# EasyEDA Pro project ProPrj_SunLight_2026-07-16.epro

# Schematic Schematic1
Assembly Variant: Basic; Board Name: Board1; Create Date: 2026-07-05; Page Name: P1; Project Name: SunLight; Schematic Name: Schematic1; Update Date: 2026-07-05; Company: 嘉立创EDA; Page Size: A4; Version: V1.0
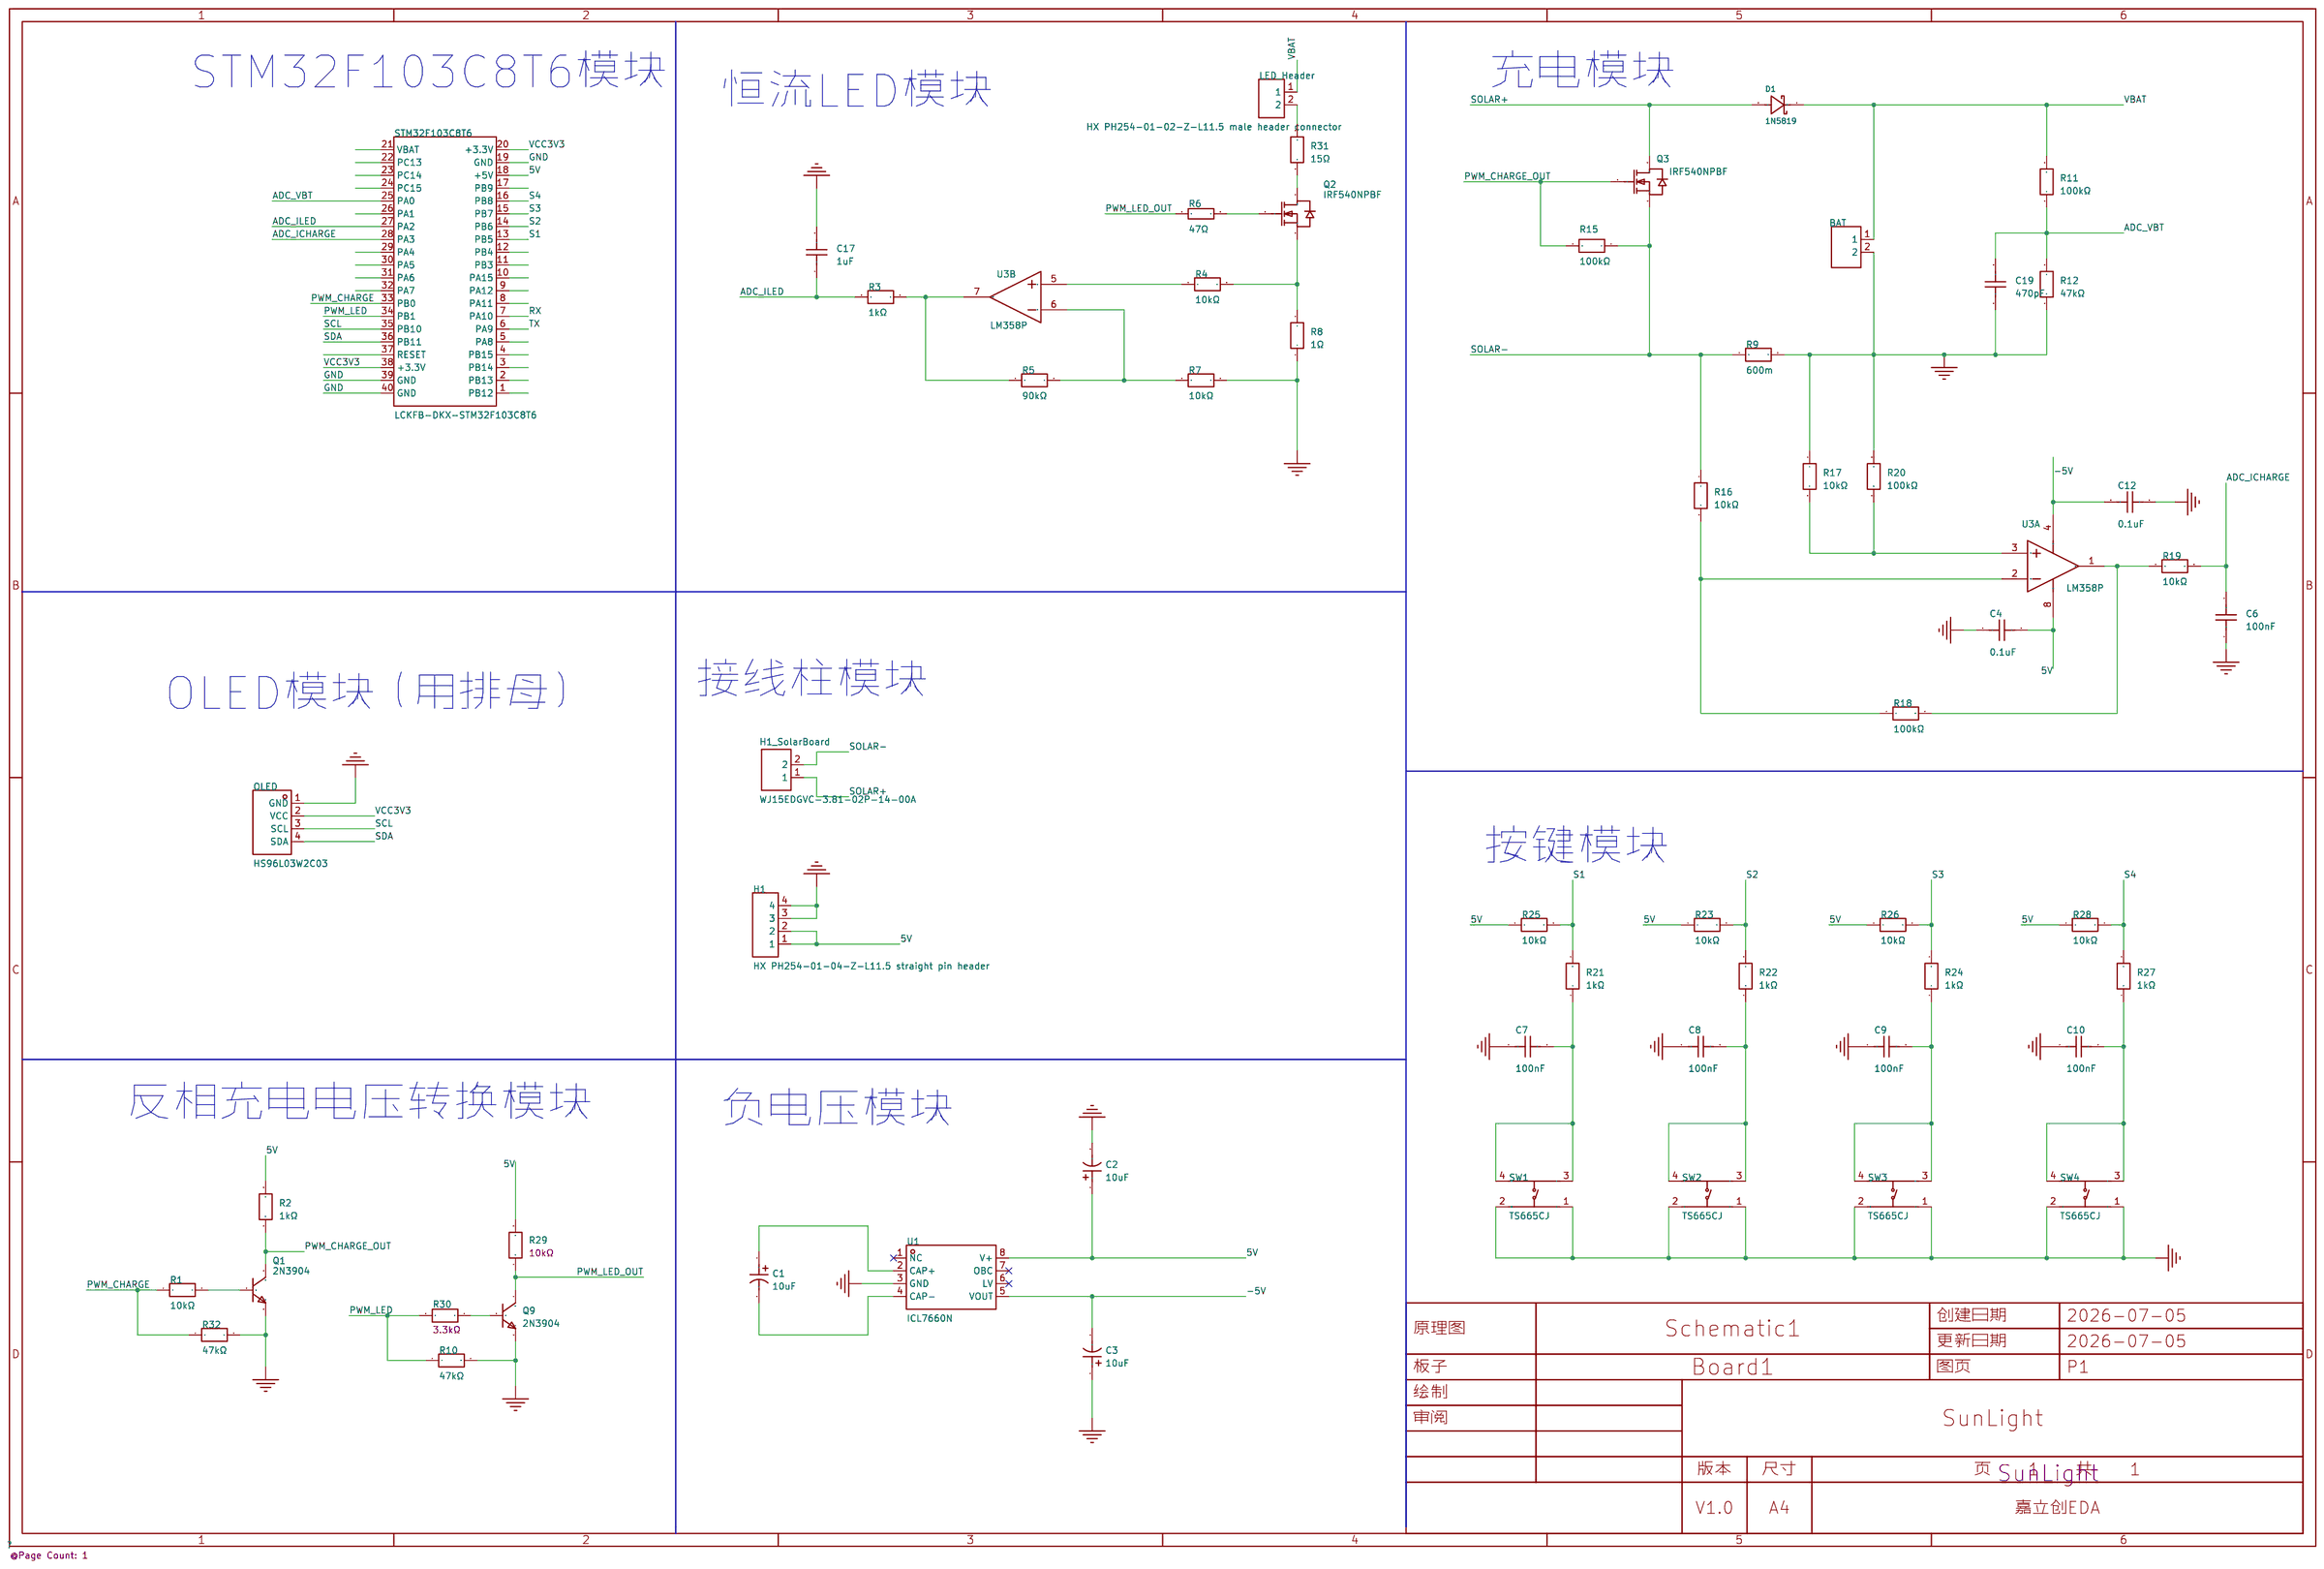
[diagram p0: schematic sheet]

## Parts
BAT  WJ15EDGVC-3.81-02P-14-00A  [CONN-TH_WJ15EDGVC-3.81-2P]
C1  10uF  [CAP-TH_BD10.0-P5.00-D0.6-FD_1]
C2  10uF  [CAP-TH_BD10.0-P5.00-D0.6-FD_1]
C3  10uF  [CAP-TH_BD10.0-P5.00-D0.6-FD_1]
C4  0.1uF  [CC1H104ZA1FD3F6C1000]
C6  100nF  [CAP-TH_L5.5-W4.0-P5.00-D0.5]
C7  100nF  [CAP-TH_L5.5-W4.0-P5.00-D0.5]
C8  100nF  [CAP-TH_L5.5-W4.0-P5.00-D0.5]
C9  100nF  [CAP-TH_L5.5-W4.0-P5.00-D0.5]
C10  100nF  [CAP-TH_L5.5-W4.0-P5.00-D0.5]
C12  0.1uF  [CC1H104ZA1FD3F6C1000]
C17  1uF  [CAP-TH_L5.8-W2.8]
C19  470pF  [CAP-TH_L5.5-W4.0-P5.00-D0.5]
D1  1N5819  [DO-41_BD2.4-L4.7-P8.70-D0.9-RD]
H1  HX PH254-01-04-Z-L11.5 straight pin header  [HDR-TH_4P-HX-PH254-01-04-Z-L11.5]
H1_SolarBoard  WJ15EDGVC-3.81-02P-14-00A  [CONN-TH_WJ15EDGVC-3.81-2P]
LED_Header  HX PH254-01-02-Z-L11.5 male header connector  [HDR-TH_2P-P2.54-V-M]
OLED  HS96L03W2C03  [OLED-TH_L27.8-W27.2-P2.54_C9900033791]
Q1  2N3904  [TO-92-3_L4.6-W3.6-P1.27-L_1]
Q2  IRF540NPBF  [TO-220-3_L10.0-W4.5-P2.54-L]
Q3  IRF540NPBF  [TO-220-3_L10.0-W4.5-P2.54-L]
Q9  2N3904  [TO-92-3_L4.6-W3.6-P1.27-L_1]
R1  10kΩ  [RES-TH_BD2.7-L6.2-P10.20-D0.4]
R2  1kΩ  [RES-TH_BD2.7-L6.2-P10.20-D0.4]
R3  1kΩ  [RES-TH_BD2.7-L6.2-P10.20-D0.4]
R4  10kΩ  [RES-TH_BD2.7-L6.2-P10.20-D0.4]
R5  90kΩ  [RES-TH_BD2.7-L6.2-P10.20-D0.4]
R6  47Ω  [RES-TH_BD2.4-L6.3-P10.30-D0.6]
R7  10kΩ  [RES-TH_BD2.7-L6.2-P10.20-D0.4]
R8  1Ω  [RES-TH_BD2.7-L6.2-P10.20-D0.4]
R9  600m  [RES-TH_BD2.7-L6.2-P10.20-D0.4]
R10  47kΩ  [RES-TH_BD2.7-L6.2-P10.20-D0.4]
R11  100kΩ  [RES-TH_BD2.7-L6.2-P10.20-D0.4]
R12  47kΩ  [RES-TH_BD2.7-L6.2-P10.20-D0.4]
R15  100kΩ  [RES-TH_BD2.7-L6.2-P10.20-D0.4]
R16  10kΩ  [RES-TH_BD2.7-L6.2-P10.20-D0.4]
R17  10kΩ  [RES-TH_BD2.7-L6.2-P10.20-D0.4]
R18  100kΩ  [RES-TH_BD2.7-L6.2-P10.20-D0.4]
R19  10kΩ  [RES-TH_BD2.7-L6.2-P10.20-D0.4]
R20  100kΩ  [RES-TH_BD2.7-L6.2-P10.20-D0.4]
R21  1kΩ  [RES-TH_BD2.7-L6.2-P10.20-D0.4]
R22  1kΩ  [RES-TH_BD2.7-L6.2-P10.20-D0.4]
R23  10kΩ  [RES-TH_BD2.7-L6.2-P10.20-D0.4]
R24  1kΩ  [RES-TH_BD2.7-L6.2-P10.20-D0.4]
R25  10kΩ  [RES-TH_BD2.7-L6.2-P10.20-D0.4]
R26  10kΩ  [RES-TH_BD2.7-L6.2-P10.20-D0.4]
R27  1kΩ  [RES-TH_BD2.7-L6.2-P10.20-D0.4]
R28  10kΩ  [RES-TH_BD2.7-L6.2-P10.20-D0.4]
R29  1kΩ  [RES-TH_BD2.7-L6.2-P10.20-D0.4]
R30  1kΩ  [RES-TH_BD2.7-L6.2-P10.20-D0.4]
R31  15Ω  [RES-TH_BD2.7-L6.2-P10.20-D0.4]
R32  47kΩ  [RES-TH_BD2.7-L6.2-P10.20-D0.4]
STM32F103C8T6  LCKFB-DKX-STM32F103C8T6  [CONN-TH_L53.3-W22.9_STM32F103C8T6-CARD]
SW1  TS665CJ  [SW-TH_4P-L6.0-W6.0-P4.50-LS6.5]
SW2  TS665CJ  [SW-TH_4P-L6.0-W6.0-P4.50-LS6.5]
SW3  TS665CJ  [SW-TH_4P-L6.0-W6.0-P4.50-LS6.5]
SW4  TS665CJ  [SW-TH_4P-L6.0-W6.0-P4.50-LS6.5]
U1  ICL7660N  [DIP-8_L9.4-W6.4-P2.54-LS9.1-BL]
U3  LM358P  [DIP-8_L9.7-W6.4-P2.54-LS7.6-BL]  (sections 1,2)

## Library data of the parts
BAT H1_SolarBoard = WJ15EDGVC-3.81-02P-14-00A: 连接器类型:板端/插座-闭口;固定方式:-;结构:1x2P;间距:3.81mm;颜色:绿色;安装方式:直插;排数:1;每排PIN数:2;额定电流:8A;额定电压:300V;线规 - AWG:-;线规 - 平方毫米:-;工作温度:-40℃~+105℃;; LCSC Part Name: 1x2P 3.81mm 排数:1 每排P数:2; Supplier Part: C8396; Manufacturer: KANGNEX(康奈克斯电气); Supplier Footprint: 插件,P=3.81mm; JLCPCB Part Class: Extended Part; Datasheet: https://item.szlcsc.com/datasheet/WJ15EDGVC-3.81-02P-14-00A/8890.html; Supplier: LCSC; Connector Type: 板端/插座-闭口; Number of Positions or Pins: 1x2P; Pitch: 3.81mm; Color: 绿色; Mounting Type: 直插; Number of Pins: 2P; Number of Rows: 1; Number of PINs Per Row: 2; Current Rating: 8A; Voltage Rating (Max): 300V; Operating Temperature: -40℃~+105℃
C1-C3 = ERG450V10M10x16: 容值:10uF;精度:±20%;额定电压:450V;纹波电流:100mA@100kHz;等效串联电阻(ESR):9.45Ω@100kHz;; LCSC Part Name: 10uF ±20% 450V; Supplier Part: C46552835; Manufacturer: JIERR(捷而瑞); Supplier Footprint: 插件,D10xL16mm; JLCPCB Part Class: Extended Part; Datasheet: https://item.szlcsc.com/datasheet/ERG450V10M10x16/48687203.html; Supplier: LCSC; Tolerance: ±20%; Voltage Rating: 450V; Ripple Current: 100mA@100kHz; Equivalent Series Resistance(ESR): 9.45Ω@100kHz; Pin Spacing: 5mm; Diameter: 10mm; Height - Seated (Max): 16mm; Lifetime: 2000hrs@105℃; Operating Temperature: -25℃~+105℃
C4 C12 = CC1H104ZA1ED3F5O1100: 容值:100nF;精度:-20%~+80%;额定电压:50V;温度系数:Y5V;; LCSC Part Name: 100nF -20%~+80% 50V; Supplier Part: C2761728; Manufacturer: Dersonic(德尔创); Supplier Footprint: 插件,P=2.54mm; JLCPCB Part Class: 扩展库; Datasheet: https://atta.szlcsc.com/upload/public/pdf/source/20211025/1A7587EB9213FE403B9063878B9D301B.pdf; Supplier: LCSC; Tolerance: -20%~+80%; Voltage Rated: 50V; Lead Spacing: 2.54mm; Temperature Coefficient: Y5V; φD: 5.8mm; Body Thickness: 2.6mm
C6-C10 C19 = Y5P102K2KV16CC0224: 容值:1nF;精度:±10%;额定电压:2kV;温度系数:SL;; LCSC Part Name: 1nF ±10% 2kV; Supplier Part: C2887266; Manufacturer: KNSCHA(科尼盛); Supplier Footprint: 插件,P=5mm; JLCPCB Part Class: Extended Part; Datasheet: https://item.szlcsc.com/datasheet/Y5P102K2KV16CC0224/3103834.html; Supplier: LCSC; Tolerance: ±10%; Voltage Rating: 2kV; Pin Spacing: 5mm; Temperature Coefficient: SL
C17 = CC1H104MC1FD3F6C10SA: 容值:100nF;精度:±20%;额定电压:50V;温度系数:Y5V;; LCSC Part Name: 100nF ±20% 50V; Supplier Part: C5375966; Manufacturer: Dersonic(德尔创); Supplier Footprint: 插件,P=5.08mm; JLCPCB Part Class: Extended Part; Datasheet: https://item.szlcsc.com/datasheet/CC1H104MC1FD3F6C10SA/6236644.html; Supplier: LCSC; Tolerance: ±20%; Voltage Rating: 50V; Pin Spacing: 5.08mm; Temperature Coefficient: Y5V; Diameter: 5.8mm; Body Thickness: 2.4mm
D1 = 1N5819_C54795756: 二极管配置:1个独立式;正向压降(Vf):550mV@1A;直流反向耐压(Vr):40V;整流电流:1A;; Supplier Part: C54795756; Manufacturer: R+O(宏嘉诚); Supplier Footprint: DO-41; JLCPCB Part Class: Extended Part; Datasheet: https://item.szlcsc.com/datasheet/1N5819/58234768.html; Supplier: LCSC; Diode Configuration: 1个独立式; Voltage - Forward(Vf@If): 550mV@1A; Voltage - DC Reverse(Vr): 40V; Current - Rectified: 1A; Reverse Leakage Current (Ir): 200uA@40V
H1 = HX PH254-01-04-Z-L11.5 straight pin header: 插针结构:1x4P;间距:2.54mm;圆针/方针:方针;安装方式:直插;排数:单排;总PIN位数:4P;额定电流:3A;额定电压:1kV;配合针长度:6mm;塑高:2.5mm;端接针长度:3mm;触头材质:黄铜;触头镀层:金;工作温度:-40℃~+105℃;; LCSC Part Name: 1x4P 间距:2.54mm 方针 直插; Supplier Part: C52016392; Manufacturer: hanxia(韩下); Supplier Footprint: 插件,P=2.54mm; JLCPCB Part Class: Extended Part; Datasheet: https://item.szlcsc.com/datasheet/HX%2520PH254-01-04-Z-L11.5%2520straight%2520pin%2520header/54760437.html; Supplier: LCSC; Pin Structure: 1x4P; Pitch: 2.54mm; Circluar Pins/Square Pins: 方针; Mounting Type: 直插; Number of Rows: 单排; Number of Pins: 4P; Current Rating: 3A; Voltage Rating (Max): 1kV; Length of Mating Pin: 6mm; Insulation Height: 2.5mm; Length of End Connection Pin: 3mm; Contact Material: 黄铜; Contact Plating: 金; Operating Temperature: -40℃~+105℃
LED_Header = HX PH254-01-02-Z-L11.5 male header connector: 插针结构:1x2P;间距:2.54mm;圆针/方针:方针;安装方式:直插;排数:单排;总PIN位数:2P;额定电流:3A;额定电压:1kV;配合针长度:6mm;塑高:2.5mm;端接针长度:3mm;触头材质:黄铜;触头镀层:金;工作温度:-40℃~+105℃;; LCSC Part Name: 1x2P 间距:2.54mm 方针 直插; Supplier Part: C52016390; Manufacturer: hanxia(韩下); Supplier Footprint: 插件,P=2.54mm; JLCPCB Part Class: Extended Part; Datasheet: https://item.szlcsc.com/datasheet/HX%2520PH254-01-02-Z-L11.5%2520male%2520header%2520connector/54760435.html; Supplier: LCSC; Pin Structure: 1x2P; Pitch: 2.54mm; Circluar Pins/Square Pins: 方针; Mounting Type: 直插; Number of Rows: 单排; Number of Pins: 2P; Current Rating: 3A; Voltage Rating (Max): 1kV; Length of Mating Pin: 6mm; Insulation Height: 2.5mm; Length of End Connection Pin: 3mm; Contact Material: 黄铜; Contact Plating: 金; Operating Temperature: -40℃~+105℃
OLED = HS96L03W2C03: 核心芯片:SSD1315芯片;接口类型:I2C;尺寸(inch):0.96;像素分辨率:128x64;; LCSC Part Name: 0.96寸OLED显示屏窄白光IIC; Supplier Part: C5248080; Manufacturer: HS(汉昇); JLCPCB Part Class: Extended Part; Datasheet: https://item.szlcsc.com/datasheet/HS96L03W2C03/5960631.html; Supplier: LCSC; Controller Type: SSD1315芯片; Interface: I2C; Size: 0.96; Dot Pixels: 128x64; Operating Temperature: -40℃~+70℃; Type of Drive: 无源(PMOLED); Display Range: 21.744x10.864mm; Display Color: 白色; Luminance: 180cd/m2
Q1 Q9 = 2N3904_C2874602: 晶体管类型:NPN;集电极电流(Ic):200mA;集射极击穿电压(Vceo):40V;耗散功率(Pd):625mW;直流电流增益(hFE):-;; LCSC Part Name: NPN 电流:200mA 电压:40V; Supplier Part: C2874602; Manufacturer: JSMSEMI(杰盛微); Supplier Footprint: TO-92; JLCPCB Part Class: Extended Part; Datasheet: https://item.szlcsc.com/datasheet/2N3904/3079917.html; Supplier: LCSC; type: NPN; Current - Collector(Ic): 200mA; Collector - Emitter Voltage VCEO: 40V; Pd - Power Dissipation: 625mW; Transition frequency(fT): 300MHz; Current - Collector Cutoff: 50nA; Vce Saturation(VCE(sat)): 300mV@50mA,5.0mA; Operating Temperature: -55℃~+150℃; Emitter-Base Voltage(Vebo): 6V; Number: 1个NPN
Q2 Q3 = IRF540NPBF: 类型:1个N沟道;漏源电压(Vdss):100V;连续漏极电流(Id):33A;导通电阻(RDS(on)@Vgs,Id):44mΩ@10V,16A;功率(Pd):130W;阈值电压(Vgs(th)@Id):4V@250uA;; LCSC Part Name: 1个N沟道 耐压:100V 电流:33A; Supplier Part: C2566; Manufacturer: Infineon(英飞凌); Supplier Footprint: TO-220AB; JLCPCB Part Class: Extended Part; Datasheet: https://atta.szlcsc.com/upload/public/pdf/source/20140818/1457707225950.pdf; Supplier: LCSC; Type: 1个N沟道; Drain Source Voltage (Vdss): 100V; Continuous Drain Current (Id): 33A; Drain Source On Resistance (RDS(on)@Vgs,Id): 44mΩ@10V,16A; Power Dissipation (Pd): 130W; Gate Threshold Voltage (Vgs(th)@Id): 4V@250uA; Total Gate Charge (Qg@Vgs): 71nC; Input Capacitance (Ciss@Vds): 1.96nF; Reverse Transfer Capacitance (Crss@Vds): 40pF; Operating Temperature: -55℃~+175℃
R1-R5 R7-R9 R11 R12 R15-R28 = MF1/4W-1K±1%-ST52: 电阻类型:金属膜电阻;阻值:1kΩ;精度:±1%;功率:250mW;温度系数:±100ppm/℃;; LCSC Part Name: 金属膜电阻 1kΩ ±1% 250mW; Supplier Part: C2903245; Manufacturer: VO(翔胜); Supplier Footprint: 插件,D2.7xL6.2mm; JLCPCB Part Class: Extended Part; Datasheet: https://item.szlcsc.com/datasheet/MF1%252F4W-1K%25C2%25B11%2525-ST52/3158996.html; Supplier: LCSC; Type: 金属膜电阻; Tolerance: ±1%; Voltage-Supply(Max): 250V; Power(Watts): 250mW; Temperature Coefficient: ±100ppm/℃; Operating Temperature: -55℃~+155℃
R6 = MFR-25FTE52-47R: 电阻类型:金属膜电阻;阻值:47Ω;精度:±1%;功率:250mW;温度系数:±50ppm/℃;; LCSC Part Name: 金属膜电阻 47Ω ±1% 250mW 铜脚，圆柱状直插; Supplier Part: C173022; Manufacturer: YAGEO(国巨); Supplier Footprint: 插件,D2.4xL6.3mm; JLCPCB Part Class: Extended Part; Datasheet: https://item.szlcsc.com/datasheet/MFR-25FTE52-47R/184411.html; Supplier: LCSC; Type: 金属膜电阻; Tolerance: ±1%; Power(Watts): 250mW; Temperature Coefficient: ±50ppm/℃; Operating Temperature: -55℃~+155℃
R10 R32 = MF1/4W-47K±1%-ST52: 电阻类型:金属膜电阻;阻值:47kΩ;精度:±1%;功率:250mW;温度系数:±350ppm/℃;; LCSC Part Name: 金属膜电阻 47kΩ ±1% 250mW; Supplier Part: C2857423; Manufacturer: VO(翔胜); Supplier Footprint: 插件,D2.7xL6.2mm; JLCPCB Part Class: Extended Part; Supplier: LCSC; Type: 金属膜电阻; Tolerance: ±1%; Overload Voltage (Max): 250V; Power(Watts): 250mW; Temperature Coefficient: ±350ppm/℃; Operating Temperature Range: -55℃~+155℃
R29 = MF1/4W-1K±1%-ST52: 电阻类型:金属膜电阻;阻值:1kΩ;精度:±1%;功率:250mW;温度系数:±100ppm/℃;; LCSC Part Name: 金属膜电阻 1kΩ ±1% 250mW; Supplier Part: C2903245; Manufacturer: VO(翔胜); Supplier Footprint: 插件,D2.7xL6.2mm; JLCPCB Part Class: Extended Part; Datasheet: https://item.szlcsc.com/datasheet/MF1%252F4W-1K%25C2%25B11%2525-ST52/3158996.html; Supplier: LCSC; Type: 金属膜电阻; Tolerance: ±1%; Voltage-Supply(Max): 250V; Power(Watts): 250mW; Temperature Coefficient: ±100ppm/℃; Operating Temperature: -55℃~+155℃; Resistance: 10kΩ
R30 = MF1/4W-1K±1%-ST52: 电阻类型:金属膜电阻;阻值:1kΩ;精度:±1%;功率:250mW;温度系数:±100ppm/℃;; LCSC Part Name: 金属膜电阻 1kΩ ±1% 250mW; Supplier Part: C2903245; Manufacturer: VO(翔胜); Supplier Footprint: 插件,D2.7xL6.2mm; JLCPCB Part Class: Extended Part; Datasheet: https://item.szlcsc.com/datasheet/MF1%252F4W-1K%25C2%25B11%2525-ST52/3158996.html; Supplier: LCSC; Type: 金属膜电阻; Tolerance: ±1%; Voltage-Supply(Max): 250V; Power(Watts): 250mW; Temperature Coefficient: ±100ppm/℃; Operating Temperature: -55℃~+155℃; Resistance: 3.3kΩ
R31 = MF1/4W-4Ω7±1%-OT26: 电阻类型:金属膜电阻;阻值:4.7Ω;精度:±1%;功率:250mW;温度系数:±400ppm/℃;; LCSC Part Name: 金属膜电阻 4.7Ω ±1% 250mW; Supplier Part: C2843026; Manufacturer: VO(翔胜); Supplier Footprint: 插件,D2.7xL6.2mm; JLCPCB Part Class: Extended Part; Datasheet: https://item.szlcsc.com/datasheet/MF1%252F4W-4%25CE%25A97%25C2%25B11%2525-OT26/3029405.html; Supplier: LCSC; Type: 金属膜电阻; Tolerance: ±1%; Voltage-Supply(Max): 250V; Power(Watts): 250mW; Temperature Coefficient: ±400ppm/℃; Operating Temperature: -55℃~+155℃
STM32F103C8T6 = LCKFB-DKX-STM32F103C8T6: 搭载Contex M3内核,程序存储容量64KB,RAM总容量20KB,最高72MHz主频,提供高效的计算能力和稳定的运行环境。; LCSC Part Name: 立创·地阔星-STM32F103C8T6开发板; Supplier Part: C22396880; Manufacturer: 立创开发板; JLCPCB Part Class: Extended Part; Datasheet: https://item.szlcsc.com/datasheet/LCKFB-DKX-STM32F103C8T6/24005615.html; Supplier: LCSC
SW1-SW4 = TS665CJ: 电路结构:单刀单掷;按钮形状:圆形按钮;作用力:2.5N;安装方式:直插;开关长度:6mm;开关宽度:6mm;开关高度:5mm;带支架:不带支架;触点电流:50mA;额定电压:12V;带灯:无;工作寿命:5万次;; LCSC Part Name: 6*6*5mm 直插 轻触开关; Supplier Part: C393938; Manufacturer: SHOU HAN(首韩); Supplier Footprint: 插件-4P,6x6mm; JLCPCB Part Class: Extended Part; Datasheet: https://item.szlcsc.com/datasheet/TS665CJ/372550.html; Supplier: LCSC; Circuit: 单刀单掷; Actuator Style: 圆形按钮; Operating Force: 2.5N; Mounting Type: 直插; Length: 6mm; Width: 6mm; Switch Height: 5mm; with Bracket: 不带支架; Contact Current: 50mA; Voltage Rating: 12V; Actuator/Cap Color: 黑色; With Lamp: 无; Termination Style: PC引脚; Life: 5万次; Operating Temperature: -25℃~+70℃
U1 = ICL7660N: DC-DC电源管理芯片  高效率、实现负电压输出的电源极性反转变换器; Supplier Part: C19193423; Manufacturer: HGSEMI(华冠); Supplier Footprint: DIP-8; JLCPCB Part Class: Extended Part; Datasheet: https://atta.szlcsc.com/upload/public/pdf/source/20231208/A47A2180530992FCCD2558815FF503B1.pdf; Supplier: LCSC
U3 = LM358P_C5330384: 放大器数:2;轨到轨:-;增益带宽积(GBW):1MHz;输入失调电压(Vos):2mV;压摆率(SR):-;输入偏置电流(Ib):45nA;; LCSC Part Name: 双运算放大器; Supplier Part: C5330384; Manufacturer: Slkor(萨科微); Supplier Footprint: DIP-8; JLCPCB Part Class: Extended Part; Datasheet: https://item.szlcsc.com/datasheet/LM358P/6089161.html; Supplier: LCSC; Number of Channels: 2; Maximum Power Supply Range (Vdd-Vss): 36V; Gain Bandwidth Product: 1MHz; Vos - Input Offset Voltage: 2mV; Ib - Input Bias Current: 45nA; Input Offset Current(Ios): 3nA; Common Mode Rejection Ratio(CMRR): 85dB; Quiescent Current: 500uA; Output Current: 40mA; Operating Temperature: 0℃~+70℃; Single supply: 3V~36V; Dual Supply: -1.5V~18V

## Nets
5V: C2.1 C4.2 H1.1 H1.2 R2.2 R23.1 R25.1 R26.1 R28.1 R29.2 STM32F103C8T6.18(+5V) U1.8(V+) U3.8(VCC)
-5V: C3.2 C12.2 U1.5(VOUT) U3.4(GND)
GND: BAT.2 C2.2 C3.1 C4.1 C6.1 C7.1 C8.1 C9.1 C10.1 C12.1 C17.2 C19.1 H1.3 H1.4 OLED.1(GND) Q1.3(E) Q9.3(E) R7.2 R8.1 R9.2 R10.2 R12.1 R17.1 R20.2 R32.2 STM32F103C8T6.19(GND) STM32F103C8T6.39(GND) STM32F103C8T6.40(GND) SW1.1(A) SW1.2(B) SW2.1(A) SW2.2(B) SW3.1(A) SW3.2(B) SW4.1(A) SW4.2(B) U1.3(GND)
VBAT: BAT.1 D1.1(C) LED_Header.1 R11.2
VCC3V3: OLED.2(VCC) STM32F103C8T6.20(+3.3V) STM32F103C8T6.38(+3.3V)
ADC_ICHARGE: C6.2 R19.2 STM32F103C8T6.28(PA3)
ADC_ILED: C17.1 R3.1 STM32F103C8T6.27(PA2)
ADC_VBT: C19.2 R11.1 R12.2 STM32F103C8T6.25(PA0)
PWM_CHARGE: R1.1 R32.1 STM32F103C8T6.33(PB0)
PWM_CHARGE_OUT: Q1.1(C) Q3.1(G) R2.1 R15.2
PWM_LED: R10.1 R30.2 STM32F103C8T6.34(PB1)
PWM_LED_OUT: Q9.1(C) R6.1 R29.1
RX: STM32F103C8T6.7(PA10)
S1: R21.2 R25.2 STM32F103C8T6.13(PB5)
S2: R22.2 R23.2 STM32F103C8T6.14(PB6)
S3: R24.2 R26.2 STM32F103C8T6.15(PB7)
S4: R27.2 R28.2 STM32F103C8T6.16(PB8)
SCL: OLED.3(SCL) STM32F103C8T6.35(PB10)
SDA: OLED.4(SDA) STM32F103C8T6.36(PB11)
SOLAR+: D1.2(A) H1_SolarBoard.1 Q3.2(D)
SOLAR-: H1_SolarBoard.2 Q3.3(S) R9.1 R15.1 R16.1
TX: STM32F103C8T6.6(PA9)
$1N47: Q1.2(B) R1.2
$1N60: C1.1 U1.2(CAP+)
$1N61: C1.2 U1.4(CAP-)
$1N72: R3.2 R5.1 U3.7(OUT2)
$1N76: Q2.3(S) R4.2 R8.2
$1N96: R16.2 R18.1 U3.2(IN1-)
$1N97: R18.2 R19.1 U3.1(OUT1)
$1N102: C7.2 R21.1 SW1.3(C) SW1.4(D)
$1N111: C8.2 R22.1 SW2.3(C) SW2.4(D)
$1N116: C9.2 R24.1 SW3.3(C) SW3.4(D)
$1N121: C10.2 R27.1 SW4.3(C) SW4.4(D)
$1N162: Q9.2(B) R30.1
$1N174: Q2.2(D) R31.1
$1N175: LED_Header.2 R31.2
$1N181: R4.1 U3.5(IN2+)
$1N184: R5.2 R7.1 U3.6(IN2-)
$1N187: Q2.1(G) R6.2
$1N191: R17.2 R20.1 U3.3(IN1+)

Not connected (* = marked no-connect by the designer): STM32F103C8T6 1(PB12) 2(PB13) 3(PB14) 4(PB15) 5(PA8) 8(PA11) 9(PA12) 10(PA15) 11(PB3) 12(PB4) 17(PB9) 21(VBAT) 22(PC13) 23(PC14) 24(PC15) 26(PA1) 29(PA4) 30(PA5) 31(PA6) 32(PA7) 37(RESET); U1 1(NC)* 6(LV)* 7(OBC)*

## Notes on the sheet
- STM32F103C8T6模块
- 充电模块
- 恒流LED模块
- 接线柱模块
- OLED模块（用排母）
- 按键模块
- 反相充电电压转换模块
- 负电压模块

# Board PCB1
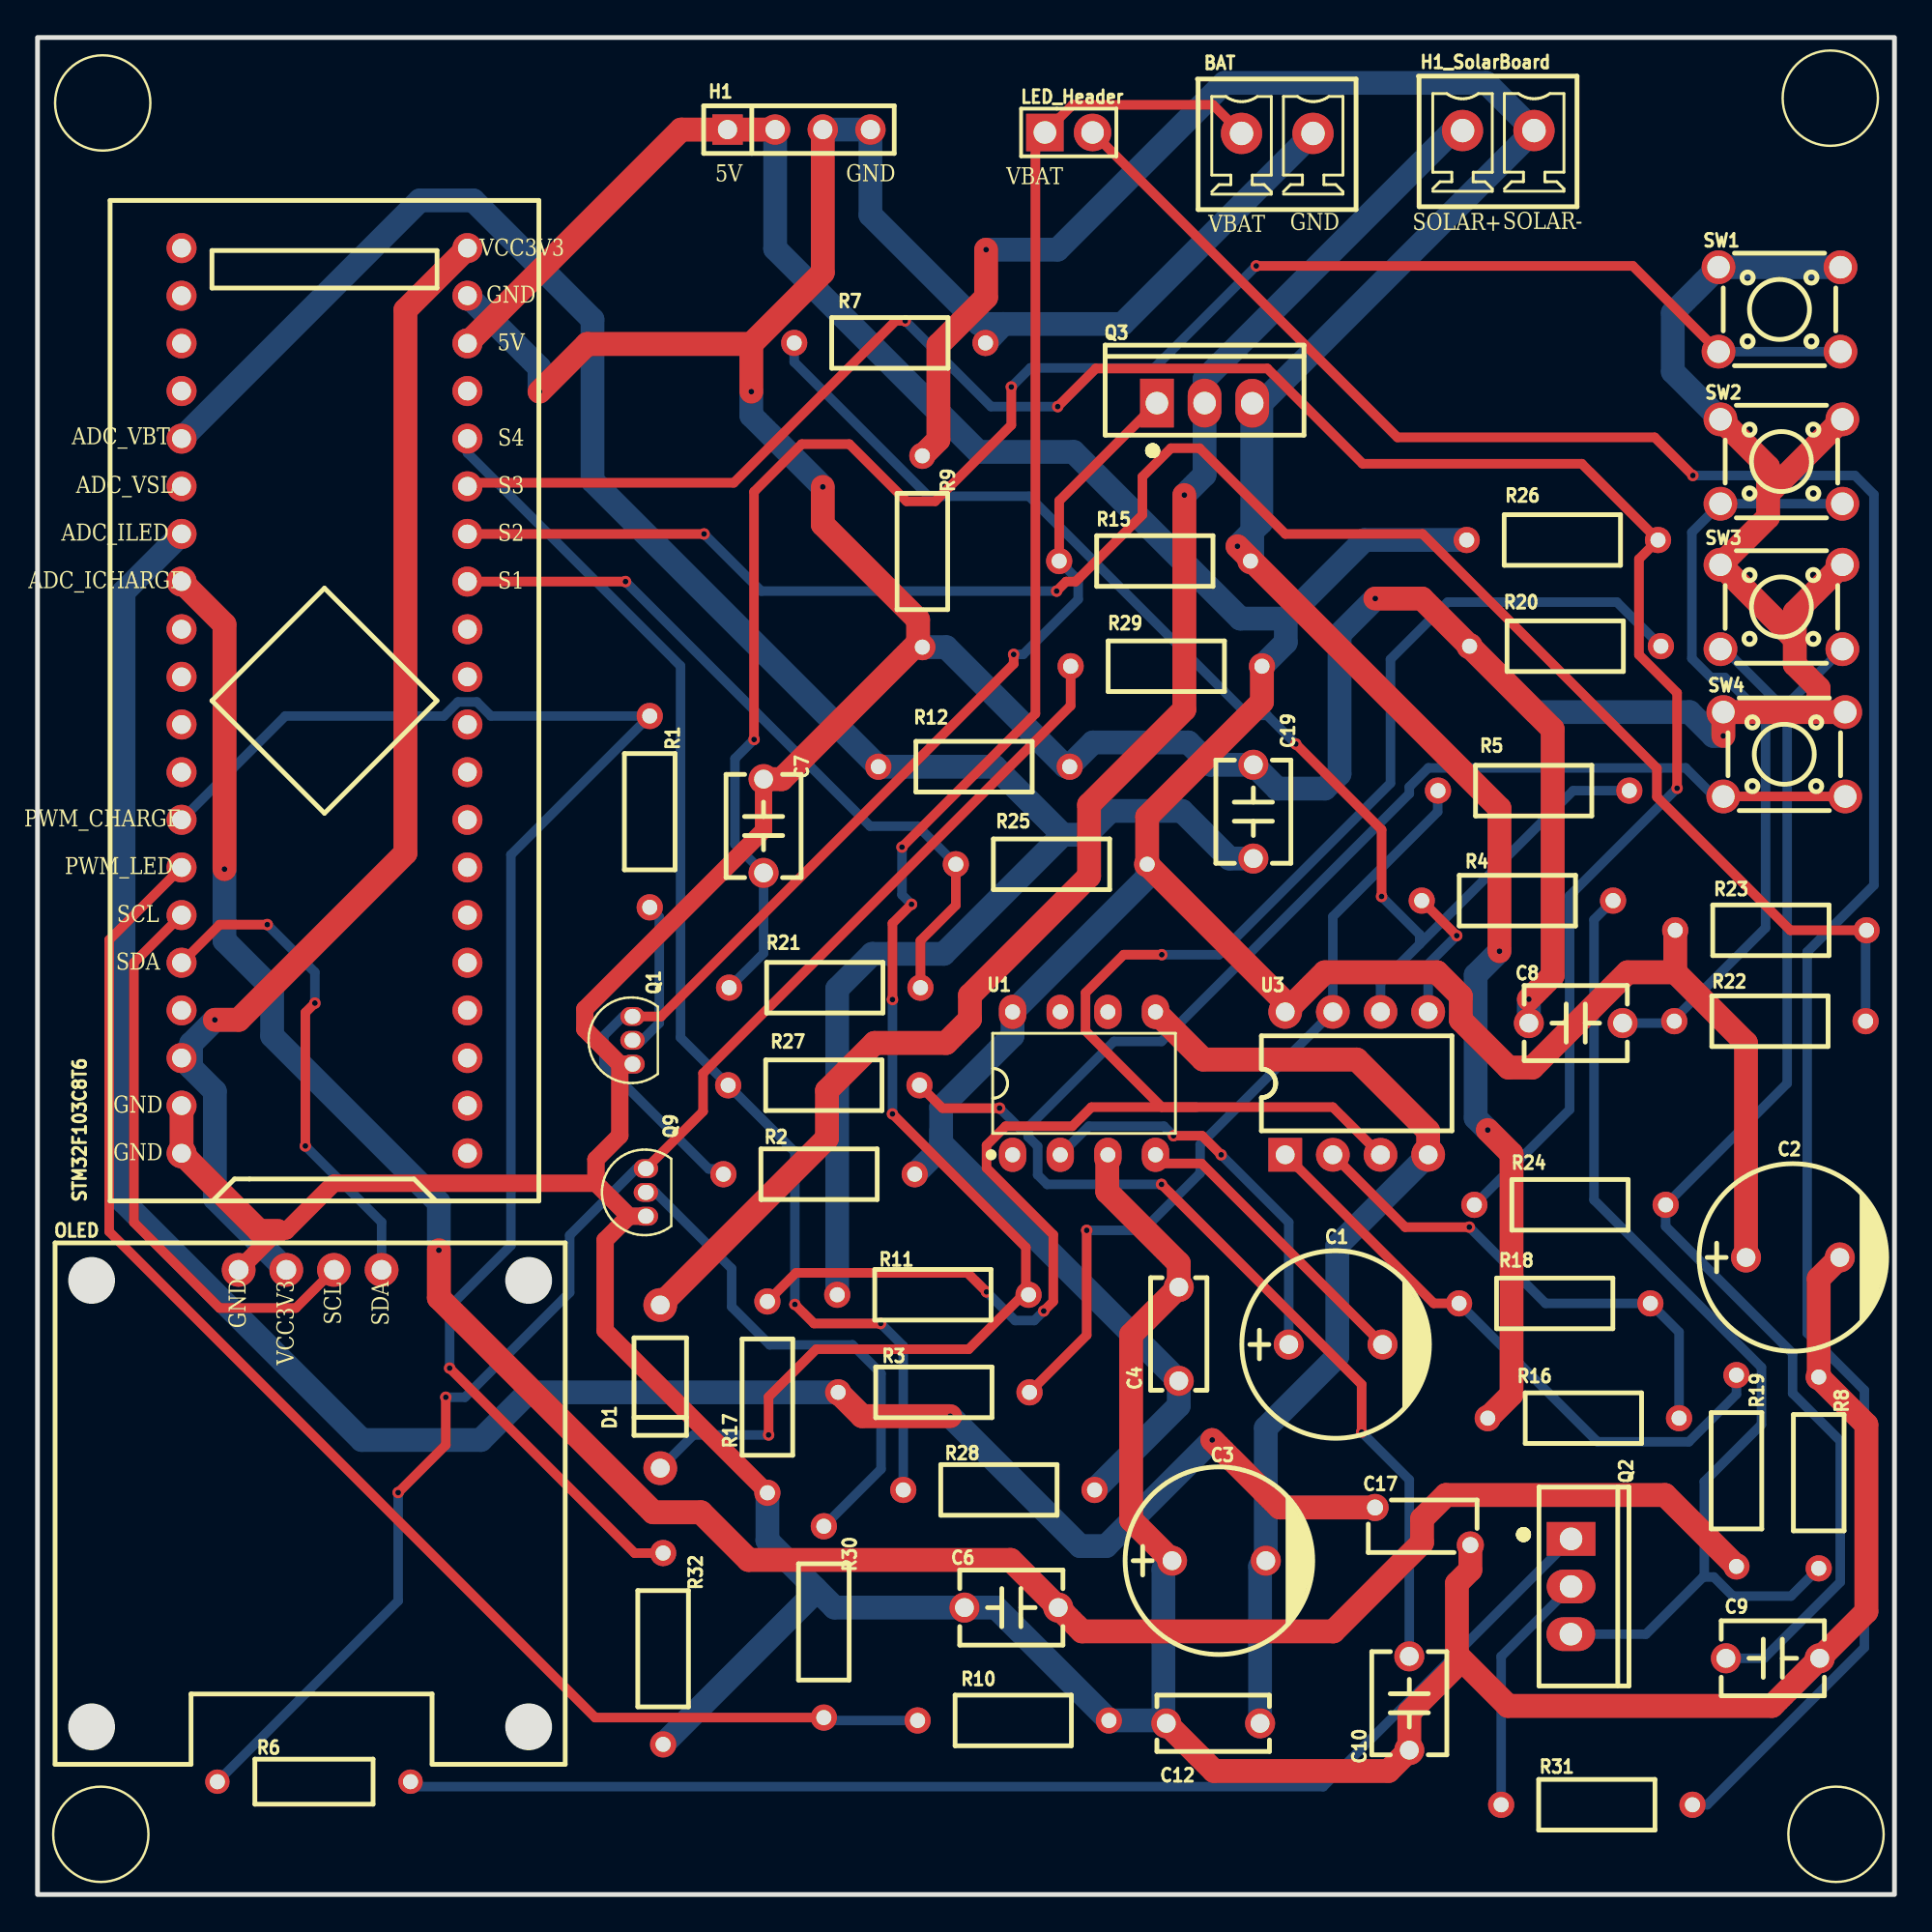
[diagram p1: board, top side]
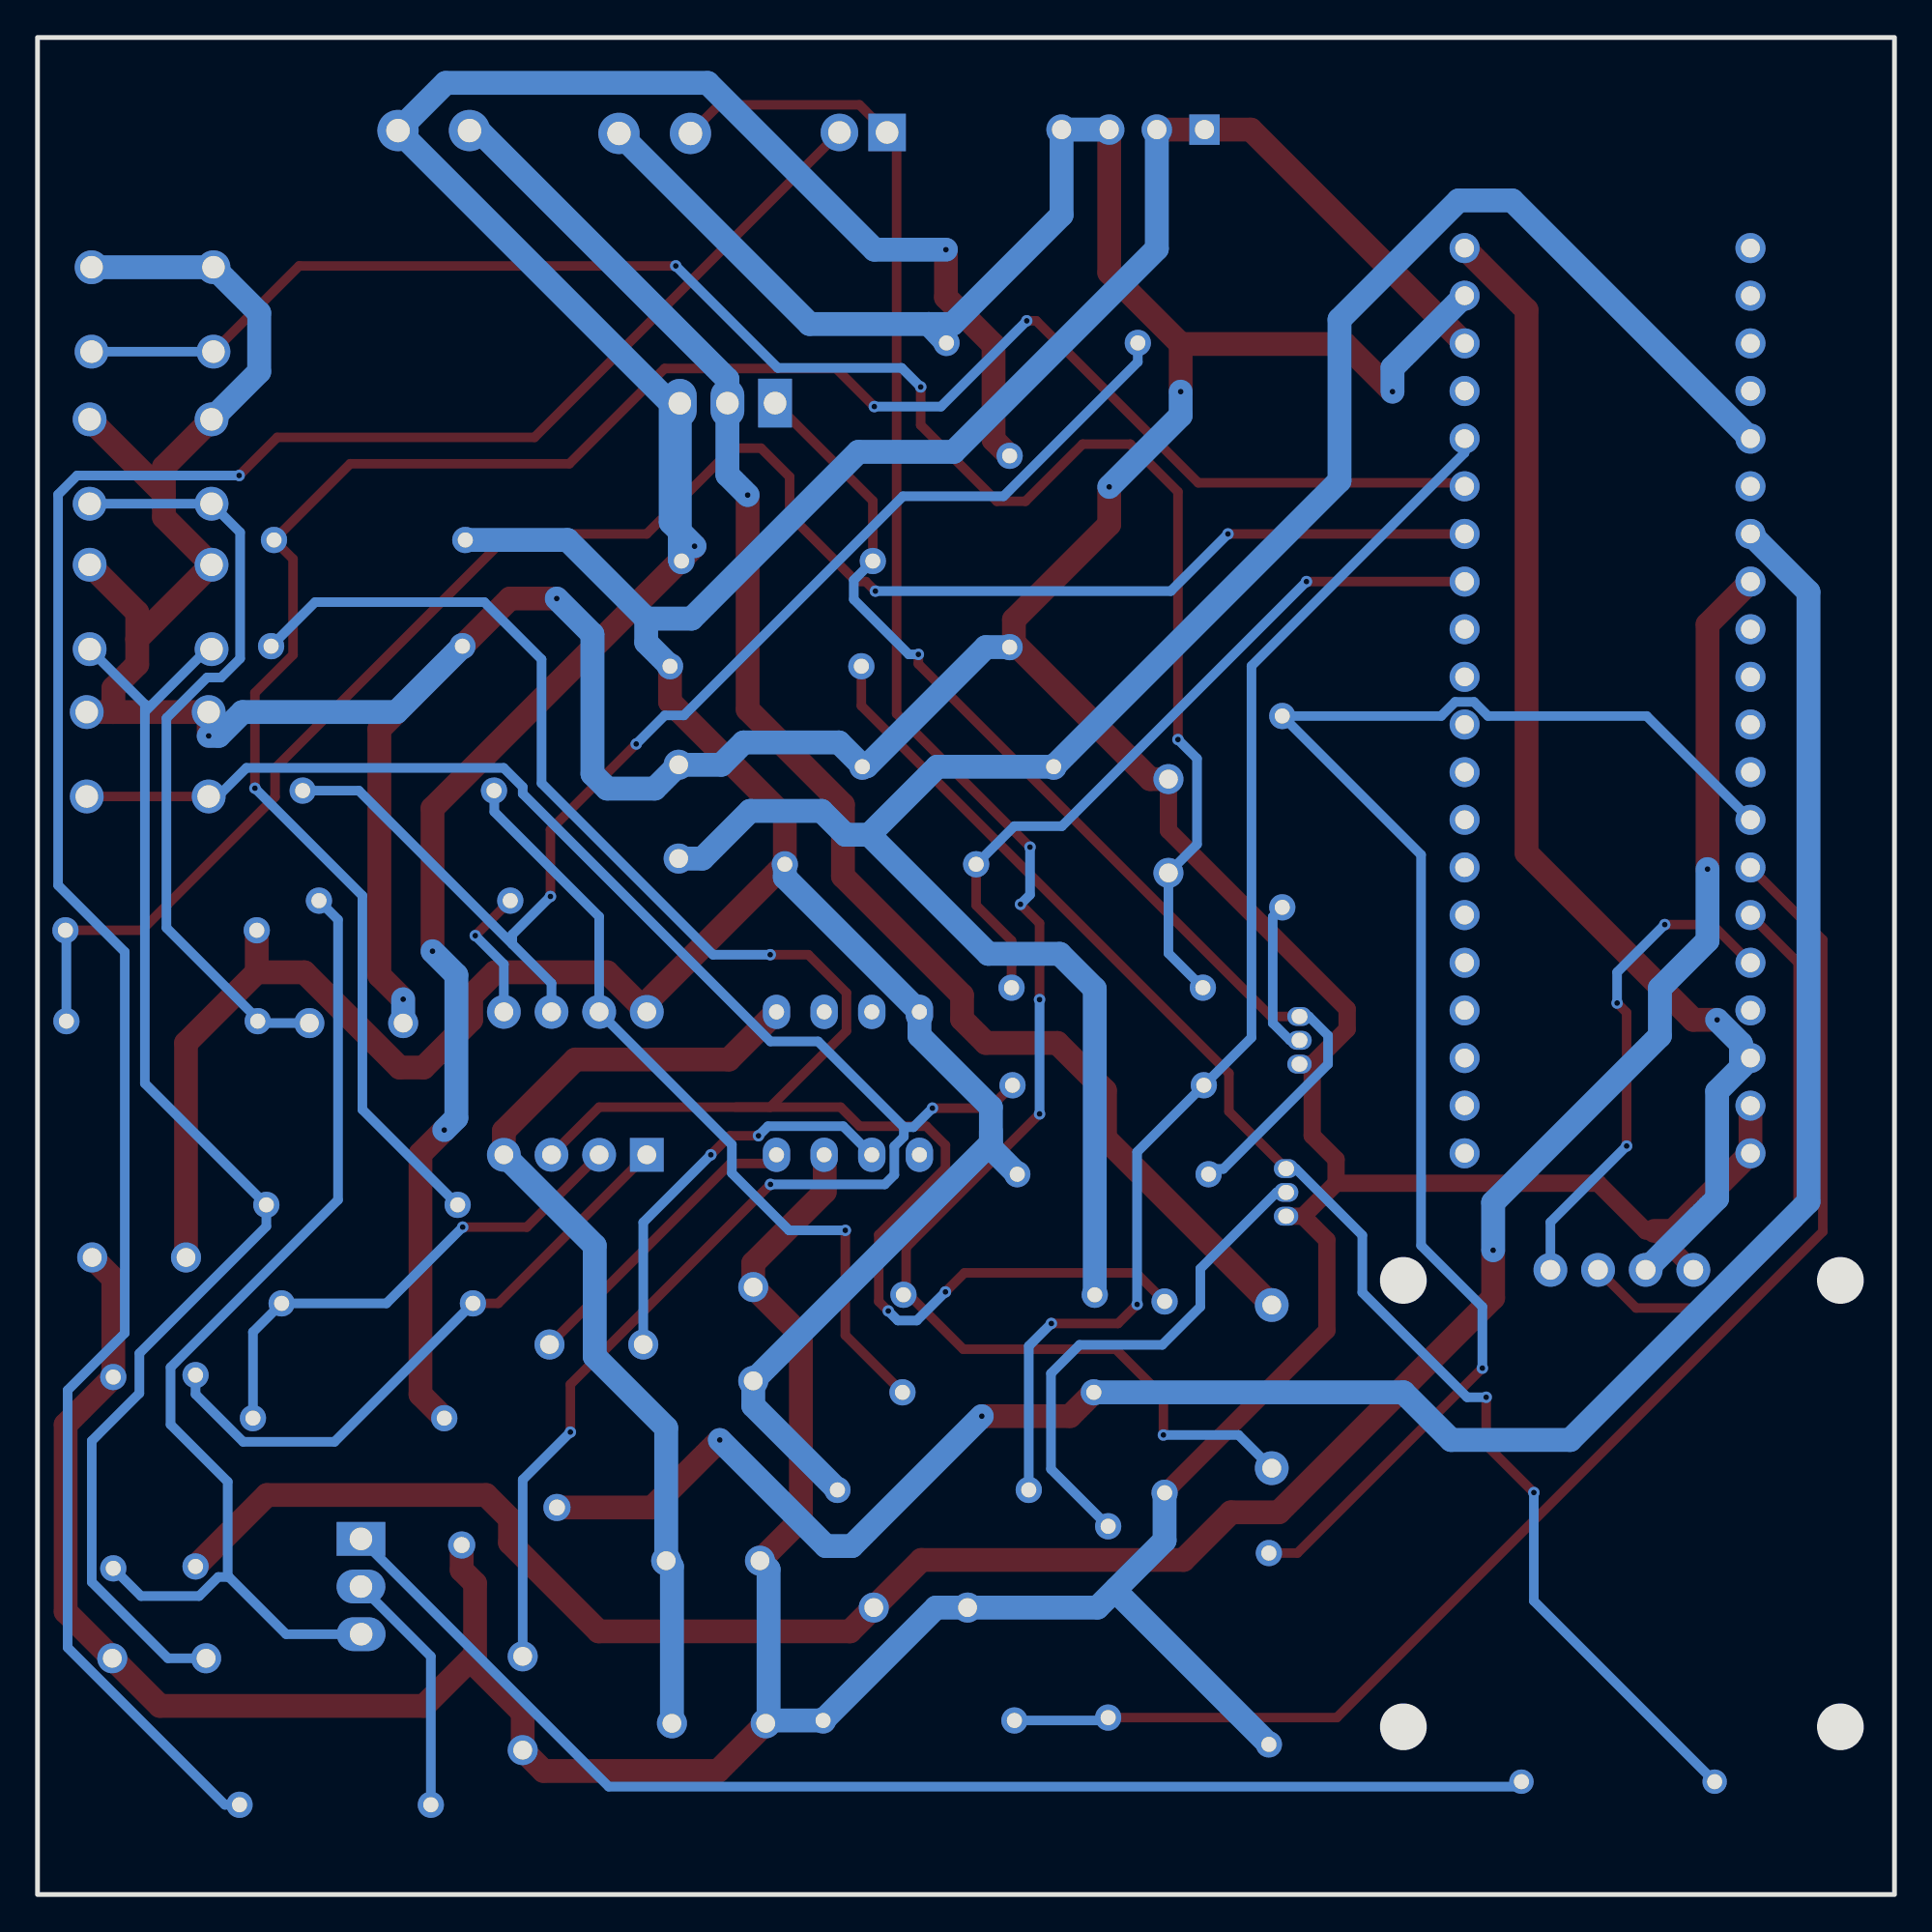
[diagram p2: board, bottom side, seen from below]

Outline 99 x 99 mm; copper layers: Top Layer, Bottom Layer. Coordinates in mm from the lower left corner of the outline.
Outline path: rectangle 0,99 99,0
Stack: Top Layer 0.035mm / Dielectric1 1.51mm FR4 er 4.5 / Bottom Layer 0.035mm

## Design rules (mm)
spacing 普通 (default): track to track 0.508, other pairs 0.152 to 0.3
spacing 高级: track to track 1.27, other pairs 0.152 to 0.3
spacing Plane_innerPlane: track to track 0.508, other pairs 0.152 to 0.3
spacing Copper_copperRegion: track to track 0.508, other pairs 0.152 to 0.3
track width copperThickness1oz (default): min 0.127, default 0.508, max 2.54
track width trackWidth1: min 0.127, default 1.27, max 2.54
differential pair differentialPair (default): width min 0.127, default 0.254, max 2.54; gap min 0.152, default 0.152
net VCC3V3 uses trackWidth1, 高级
net SOLAR+ uses trackWidth1, 高级
net ADC_VBT uses trackWidth1, 高级
net SOLAR- uses trackWidth1, 高级
net ADC_ILED uses trackWidth1, 高级
net ADC_ICHARGE uses trackWidth1, 高级
net -5V uses trackWidth1, 高级
net GND uses trackWidth1, 高级
net 5V uses trackWidth1, 高级

## Placement (name value [footprint] x y rotation side)
BAT  WJ15EDGVC-3.81-02P-14-00A  [CONN-TH_WJ15EDGVC-3.81-2P]  66.09 93.89 0 top
C1  10uF  [CAP-TH_BD10.0-P5.00-D0.6-FD_1]  69.21 29.32 0 top
C2  10uF  [CAP-TH_BD10.0-P5.00-D0.6-FD_1]  93.58 33.96 0 top
C3  10uF  [CAP-TH_BD10.0-P5.00-D0.6-FD_1]  62.98 17.79 0 top
C4  0.1uF  [CC1H104ZA1FD3F6C1000]  60.84 29.88 270 top
C6  100nF  [CAP-TH_L5.5-W4.0-P5.00-D0.5]  51.92 15.3 0 top
C7  100nF  [CAP-TH_L5.5-W4.0-P5.00-D0.5]  38.71 56.96 270 top
C8  100nF  [CAP-TH_L5.5-W4.0-P5.00-D0.5]  82.01 46.46 0 top
C9  100nF  [CAP-TH_L5.5-W4.0-P5.00-D0.5]  92.51 12.59 180 top
C10  100nF  [CAP-TH_L5.5-W4.0-P5.00-D0.5]  73.13 10.2 90 top
C12  0.1uF  [CC1H104ZA1FD3F6C1000]  62.68 9.12 0 top
C17  1uF  [CAP-TH_L5.8-W2.8]  73.85 19.63 0 top
C19  470pF  [CAP-TH_L5.5-W4.0-P5.00-D0.5]  64.82 57.73 270 top
D1  1N5819  [DO-41_BD2.4-L4.7-P8.70-D0.9-RD]  33.2 27.08 90 top
H1  HX PH254-01-04-Z-L11.5 straight pin header  [HDR-TH_4P-HX-PH254-01-04-Z-L11.5]  40.59 94.09 0 top
H1_SolarBoard  WJ15EDGVC-3.81-02P-14-00A  [CONN-TH_WJ15EDGVC-3.81-2P]  77.88 94.04 0 top
LED_Header  HX PH254-01-02-Z-L11.5 male header connector  [HDR-TH_2P-P2.54-V-M]  54.98 93.94 0 top
OLED  HS96L03W2C03  [OLED-TH_L27.8-W27.2-P2.54_C9900033791]  14.53 33.3 0 top
Q1  2N3904  [TO-92-3_L4.6-W3.6-P1.27-L_1]  31.72 45.54 270 top
Q2  IRF540NPBF  [TO-220-3_L10.0-W4.5-P2.54-L]  81.75 16.42 270 top
Q3  IRF540NPBF  [TO-220-3_L10.0-W4.5-P2.54-L]  62.22 79.5 0 top
Q9  2N3904  [TO-92-3_L4.6-W3.6-P1.27-L_1]  32.44 37.43 270 top
R1  10kΩ  [RES-TH_BD2.7-L6.2-P10.20-D0.4]  32.64 57.73 270 top
R2  1kΩ  [RES-TH_BD2.7-L6.2-P10.20-D0.4]  41.67 38.4 0 top
R3  1kΩ  [RES-TH_BD2.7-L6.2-P10.20-D0.4]  47.79 26.77 0 top
R4  10kΩ  [RES-TH_BD2.7-L6.2-P10.20-D0.4]  78.9 52.98 0 top
R5  90kΩ  [RES-TH_BD2.7-L6.2-P10.20-D0.4]  79.76 58.85 0 top
R6  47Ω  [RES-TH_BD2.4-L6.3-P10.30-D0.6]  14.74 6.01 0 top
R7  10kΩ  [RES-TH_BD2.7-L6.2-P10.20-D0.4]  45.44 82.72 0 top
R8  1Ω  [RES-TH_BD2.7-L6.2-P10.20-D0.4]  94.96 22.49 270 top
R9  600m  [RES-TH_BD2.7-L6.2-P10.20-D0.4]  47.17 71.6 270 top
R10  47kΩ  [RES-TH_BD2.7-L6.2-P10.20-D0.4]  52.02 9.28 0 top
R11  100kΩ  [RES-TH_BD2.7-L6.2-P10.20-D0.4]  47.74 31.97 0 top
R12  47kΩ  [RES-TH_BD2.7-L6.2-P10.20-D0.4]  49.93 60.12 180 top
R15  100kΩ  [RES-TH_BD2.7-L6.2-P10.20-D0.4]  59.57 71.09 180 top
R16  10kΩ  [RES-TH_BD2.7-L6.2-P10.20-D0.4]  82.41 25.39 0 top
R17  10kΩ  [RES-TH_BD2.7-L6.2-P10.20-D0.4]  38.91 26.52 90 top
R18  100kΩ  [RES-TH_BD2.7-L6.2-P10.20-D0.4]  80.88 31.51 180 top
R19  10kΩ  [RES-TH_BD2.7-L6.2-P10.20-D0.4]  90.58 22.59 270 top
R20  100kΩ  [RES-TH_BD2.7-L6.2-P10.20-D0.4]  81.45 66.55 180 top
R21  1kΩ  [RES-TH_BD2.7-L6.2-P10.20-D0.4]  41.97 48.34 0 top
R22  1kΩ  [RES-TH_BD2.7-L6.2-P10.20-D0.4]  92.36 46.56 0 top
R23  10kΩ  [RES-TH_BD2.7-L6.2-P10.20-D0.4]  92.41 51.4 0 top
R24  1kΩ  [RES-TH_BD2.7-L6.2-P10.20-D0.4]  81.7 36.77 180 top
R25  10kΩ  [RES-TH_BD2.7-L6.2-P10.20-D0.4]  54.06 54.92 180 top
R26  10kΩ  [RES-TH_BD2.7-L6.2-P10.20-D0.4]  81.29 72.21 0 top
R27  1kΩ  [RES-TH_BD2.7-L6.2-P10.20-D0.4]  41.92 43.14 180 top
R28  10kΩ  [RES-TH_BD2.7-L6.2-P10.20-D0.4]  51.25 21.57 180 top
R29  1kΩ  [RES-TH_BD2.7-L6.2-P10.20-D0.4]  60.18 65.48 0 top
R30  1kΩ  [RES-TH_BD2.7-L6.2-P10.20-D0.4]  41.92 14.53 270 top
R31  15Ω  [RES-TH_BD2.7-L6.2-P10.20-D0.4]  83.13 4.78 0 top
R32  47kΩ  [RES-TH_BD2.7-L6.2-P10.20-D0.4]  33.35 13.1 270 top
STM32F103C8T6  LCKFB-DKX-STM32F103C8T6  [CONN-TH_L53.3-W22.9_STM32F103C8T6-CARD]  15.3 63.64 90 top
SW1  TS665CJ  [SW-TH_4P-L6.0-W6.0-P4.50-LS6.5]  92.87 84.5 0 top
SW2  TS665CJ  [SW-TH_4P-L6.0-W6.0-P4.50-LS6.5]  92.97 76.39 0 top
SW3  TS665CJ  [SW-TH_4P-L6.0-W6.0-P4.50-LS6.5]  92.97 68.64 0 top
SW4  TS665CJ  [SW-TH_4P-L6.0-W6.0-P4.50-LS6.5]  93.12 60.79 0 top
U1  ICL7660N  [DIP-8_L9.4-W6.4-P2.54-LS9.1-BL]  55.79 43.24 0 top
U3  LM358P  [DIP-8_L9.7-W6.4-P2.54-LS7.6-BL]  70.33 43.24 0 top

## Footprints (pads in the part's own frame, mm; a bottom-side part is the same pattern mirrored in y, then rotated)
CAP-TH_BD10.0-P5.00-D0.6-FD_1
  round 1.6 hole 1: 1(-2.5,0) 2(2.5,0)
CAP-TH_L5.5-W4.0-P5.00-D0.5
  round 1.6 hole 1: 1(-2.5,0) 2(2.5,0)
CAP-TH_L5.8-W2.8
  round 1.45 hole 0.85: 1(-2.54,1) 2(2.54,-1)
CC1H104ZA1FD3F6C1000
  round 1.6 hole 1.001: 1(-2.499,0) 2(2.499,0)
CONN-TH_L53.3-W22.9_STM32F103C8T6-CARD
  round 1.6 hole 1: 1(-24.13,-7.62) 2(-21.59,-7.62) 3(-19.05,-7.62) 4(-16.51,-7.62) 5(-13.97,-7.62) 6(-11.43,-7.62) 7(-8.89,-7.62) 8(-6.35,-7.62) 9(-3.81,-7.62) 10(-1.27,-7.62) 11(1.27,-7.62) 12(3.81,-7.62) 13(6.35,-7.62) 14(8.89,-7.62) 15(11.43,-7.62) 16(13.97,-7.62) 17(16.51,-7.62) 18(19.05,-7.62) 19(21.59,-7.62) 20(24.13,-7.62) 21(24.13,7.62) 22(21.59,7.62) 23(19.05,7.62) 24(16.51,7.62) 25(13.97,7.62) 26(11.43,7.62) 27(8.89,7.62) 28(6.35,7.62) 29(3.81,7.62) 30(1.27,7.62) 31(-1.27,7.62) 32(-3.81,7.62) 33(-6.35,7.62) 34(-8.89,7.62) 35(-11.43,7.62) 36(-13.97,7.62) 37(-16.51,7.62) 38(-19.05,7.62) 39(-21.59,7.62) 40(-24.13,7.62)
CONN-TH_WJ15EDGVC-3.81-2P
  round 2.2 hole 1.25: 1(-1.905,0) 2(1.905,0)
DIP-8_L9.4-W6.4-P2.54-LS9.1-BL
  oval 1.46x1.825 hole 0.8: 1(-3.81,-3.81) 2(-1.27,-3.81) 3(1.27,-3.81) 4(3.81,-3.81) 5(3.81,3.81) 6(1.27,3.81) 7(-1.27,3.81) 8(-3.81,3.81)
DIP-8_L9.7-W6.4-P2.54-LS7.6-BL
  rect 1.8x1.8 hole 1: 1(-3.81,-3.81)
  round 1.8 hole 1: 2(-1.27,-3.81) 3(1.27,-3.81) 4(3.81,-3.81) 5(3.81,3.81) 6(1.27,3.81) 7(-1.27,3.81) 8(-3.81,3.81)
DO-41_BD2.4-L4.7-P8.70-D0.9-RD
  round 1.8 hole 1: 1(-4.35,0) 2(4.35,0)
HDR-TH_2P-P2.54-V-M
  rect 2x2 hole 1.2: 1(-1.27,0)
  round 2 hole 1.2: 2(1.27,0)
HDR-TH_4P-HX-PH254-01-04-Z-L11.5
  rect 1.62x1.62 hole 1.02: 1(-3.81,0)
  round 1.62 hole 1.02: 2(-1.27,0) 3(1.27,0) 4(3.81,0)
OLED-TH_L27.8-W27.2-P2.54_C9900033791
  round 1.8 hole 1.05: 1(-3.81,0) 2(-1.27,0) 3(1.27,0) 4(3.81,0)
RES-TH_BD2.4-L6.3-P10.30-D0.6
  round 1.3 hole 0.8: 1(-5.15,0) 2(5.15,0)
RES-TH_BD2.7-L6.2-P10.20-D0.4
  round 1.4 hole 0.8: 1(-5.1,0) 2(5.1,0)
SW-TH_4P-L6.0-W6.0-P4.50-LS6.5
  round 1.8 hole 1.2: 1(-3.25,2.25) 2(3.25,2.25) 3(-3.25,-2.25) 4(3.25,-2.25)
TO-92-3_L4.6-W3.6-P1.27-L_1
  oval 1x1.3 hole 0.8x0.84: 1(-1.27,0) 2(0,0) 3(1.27,0)
TO-220-3_L10.0-W4.5-P2.54-L
  rect 1.8x2.6 hole 1.2: 1(-2.54,0.005)
  oval 1.8x2.6 hole 1.2: 2(0,0.005) 3(2.54,-0.005)

## Nets
As in the schematic.

Pads without a net: U1 1 6 7

## Via types
v1: diameter 0.61, hole 0.305, Top Layer to Bottom Layer, 53 vias

## Routing (per net, layer and track width the routed paths; a pad name or vN(x,y) marks a point on that pad's centre or on a via; arc(x,y) is an arc through that point)
5V: length 194.8
  Top Layer w1.268: R29.2 65.28,63.58 59.16,57.46 R25.1 66.52,47.56 U3.8 68.63,49.16 74.61,49.16 75.88,47.89 75.88,46.62 78.42,44.08 79.69,44.08 84.77,49.16 87.31,49.16 ; 87.31,49.16 91.08,45.39 C2.1 ; 87.31,49.16 R23.1
  Top Layer w1.27: H1.2 H1.1 34.32,94.09 STM32F103C8T6.18
  Bottom Layer w1.268: R26.1 70.74,72.21 66.55,68.02 ; R29.2 66.55,66.75 66.55,68.02 ; 66.55,68.02 64.13,68.02 55.24,76.91 50.16,76.91 39.33,87.74 H1.2 ; 48.17,40.7 48.17,40.05 C4.2 60.84,26.06 R28.1 ; R25.1 59.16,54.23 U1.8 51.98,45.78 48.17,41.97 48.17,39.81 R2.2
-5V: length 52.5
  Top Layer w1.27: U1.5 62.14,44.51 70.33,44.51 74.14,40.7 U3.4
  Bottom Layer w1.27: C12.2 65.18,17.49 C3.2 65.48,24.88 69.29,28.69 69.29,34.59 U3.4
GND: length 463.6
  Top Layer w0.923: 31.53,36.16 Q9.3 ; 31.53,36.16 29.77,37.92 ; 31.53,36.16 30.26,34.89 30.26,30.07 R17.1 ; 31.04,44.27 31.04,40.46 29.77,39.19 29.77,37.92 ; 31.04,44.27 Q1.3 ; 31.04,44.27 29.18,46.13 29.18,47.21 38.71,56.73 C7.1 ; OLED.1 12.8,35.38 13.26,35.38 15.8,37.92 29.77,37.92
  Top Layer w1.268: C9.1 97.5,15.08 97.5,25.05 R8.1 94.96,32.84 C2.2 ; 46.94,66.73 46.94,67.96 41.87,73.04 v1(41.87,75.04) ; 46.94,66.73 39.68,59.46 C7.1 ; 46.94,66.73 R9.2 ; H1.3 41.87,86.47 38.06,82.66 v1(38.06,80.12) ; R20.2 73.81,69.09 v1(71.32,69.09) ; v1(89.88,61.77) SW4.1
  Top Layer w1.27: 38.06,82.66 29.3,82.66 v1(26.76,80.12) ; STM32F103C8T6.39 STM32F103C8T6.40 11.81,35.38 12.8,35.38 ; U1.3 57.03,39.4 57.03,37.46 60.84,33.65 C4.1 58.3,29.84 58.3,19.98 C3.1 ; 93.69,66.85 93.69,66.93 SW3.1 92.26,73.43 92.26,76.1 SW2.1 ; C17.2 76.39,17.3 75.67,16.59 75.67,12.24 73.13,9.7 C10.1 72.02,6.59 62.72,6.59 C12.1 ; 94.96,63.04 94.96,64.31 93.69,65.58 93.69,68.35 SW3.2 ; 75.67,12.78 78.4,10.05 92.47,10.05 C9.1 ; R20.2 80.78,62.12 80.78,49 v1(79.51,47.73) ; SW2.2 92.28,74.7 92.26,74.7 ; SW4.1 SW4.2
  Bottom Layer w1.268: H1.4 44.41,89.54 50.22,83.73 51.49,83.73 ; 51.49,83.73 R7.2 ; 51.49,83.73 57.84,83.73 BAT.2 ; 33.35,8 41.45,16.1 41.45,16.34 ; R20.2 79.86,63.04 88.07,63.04 89.34,61.77 v1(89.88,61.77) ; v1(38.06,80.12) 38.06,78.85 v1(41.87,75.04) ; 55,60.15 R12.1 ; 55,60.15 54.79,60.15 48.44,66.5 R9.2 ; 55,60.15 56.27,61.42 61.35,61.42 62.55,60.23 C19.1 66.09,58.96 68.63,58.96 69.41,59.74 69.41,67.19 v1(71.32,69.09) ; C12.1 60.03,9.28 R10.2 51.1,15.3 C6.1 42.49,15.3 38.91,18.88 R17.1
  Bottom Layer w1.27: 60.03,9.28 60.03,17.34 C3.1 ; H1.4 H1.3 ; SW2.1 87.18,81.18 87.18,84.31 SW1.1 SW1.2 ; v1(79.51,47.73) C8.1 ; v1(26.76,80.12) 26.76,81.39 STM32F103C8T6.19
VBAT: length 105.1
  Top Layer w0.508: 52.69,32.12 52.69,34.5 v1(45.58,41.61) ; 52.69,32.12 R11.2 ; 52.69,32.12 49.64,29.07 41.52,29.07 38.97,26.53 v1(38.97,24.5) ; v1(45.58,47.71) 45.58,51.77 v1(46.59,52.79) ; BAT.1 62.67,95.41 55.18,95.41 LED_Header.1 53.2,93.43 53.2,62.95 v1(46.09,55.84)
  Bottom Layer w0.508: v1(46.59,52.79) 46.09,53.3 v1(46.09,55.84) ; v1(45.58,47.71) v1(45.58,41.61) ; 33.2,22.73 34.97,24.5 v1(38.97,24.5)
VCC3V3: length 64.1
  Top Layer w1.27: STM32F103C8T6.20 19.61,84.47 19.61,55.52 10.72,46.63 v1(9.45,46.63)
  Bottom Layer w1.27: 8.18,44.09 8.18,45.36 v1(9.45,46.63) ; STM32F103C8T6.38 9.45,42.82 9.45,37.11 OLED.2
ADC_ICHARGE: length 125.7
  Top Layer w1.268: C6.2 55.69,14.03 69.08,14.03 73.81,18.76 73.81,20.03 75.08,21.3 86.77,21.3 R19.2
  Top Layer w1.27: STM32F103C8T6.28 9.97,67.71 v1(9.97,54.67) ; C6.2 51.88,17.84 37.91,17.84 35.37,20.38 32.83,20.38 21.4,31.81 v1(21.4,34.35)
  Bottom Layer w1.27: v1(9.97,54.67) 9.97,50.86 12.51,48.32 12.51,45.78 21.4,36.89 v1(21.4,34.35)
ADC_ILED: length 117.1
  Top Layer w1.268: R3.1 43.96,25.5 v1(48.66,25.5) ; C17.1 66.23,20.63 v1(62.63,24.23)
  Bottom Layer w1.268: v1(62.63,24.23) 56.97,18.57 55.58,18.57 v1(48.66,25.5) ; R3.1 26.18,26.77 23.64,24.23 17.29,24.23 4.59,36.93 4.59,69.44 STM32F103C8T6.27
ADC_VBT: length 114.8
  Bottom Layer w1.268: 54.66,56.5 51.03,60.12 R12.2 29.59,75.36 29.59,83.96 23.24,90.31 20.38,90.31 STM32F103C8T6.25 ; 54.66,56.5 48.31,50.15 44.5,50.15 42.63,48.28 R11.1 ; 54.66,56.5 55.93,56.5 57.2,57.77 61.01,57.77 63.55,55.23 C19.2
PWM_CHARGE: length 82.5
  Top Layer w0.508: v1(21.97,28.06) 31.83,18.2 R32.1
  Bottom Layer w0.508: v1(21.97,28.06) 21.97,31.33 25.24,34.6 25.24,55.43 R1.1 24.17,62.83 23.42,63.58 22.42,63.58 21.67,62.83 13.21,62.83 STM32F103C8T6.33
PWM_CHARGE_OUT: length 58.6
  Top Layer w0.508: Q1.1 33.25,46.81 52.04,65.6 v1(52.04,66.11) ; Q3.1 54.47,74.3 R15.2
  Bottom Layer w0.508: Q1.1 31.21,46.81 30.2,45.79 30.2,44.27 35.78,38.68 36.28,38.68 R2.1 ; v1(52.04,66.11) 52.55,66.11 55.48,69.05 55.48,70.07 R15.2
PWM_LED: length 74.9
  Top Layer w0.508: 41.92,9.43 29.73,9.43 3.82,35.34 3.82,50.9 STM32F103C8T6.34
  Bottom Layer w0.508: R10.1 42.07,9.28 41.92,9.43
PWM_LED_OUT: length 79.2
  Top Layer w0.508: R29.1 55.08,63.38 35.48,43.78 35.48,41.75 Q9.1 ; v1(21.77,26.51) 21.77,23.97 v1(19.23,21.43)
  Bottom Layer w0.508: 9.59,6.01 19.23,15.65 v1(19.23,21.43) ; Q9.1 31.93,38.7 28.37,35.14 28.37,32.1 22.78,26.51 v1(21.77,26.51)
S1: length 39.6
  Top Layer w0.508: v1(31.35,69.99) STM32F103C8T6.13 ; R25.2 48.96,52.74 47.07,50.85 R21.2
  Bottom Layer w0.508: v1(31.35,69.99) 44.39,56.95 46.93,56.95 R25.2
S2: length 96.6
  Top Layer w0.508: v1(35.53,72.53) STM32F103C8T6.14 ; R23.2 93.45,51.4 86.34,58.52 86.34,60.04 73.84,72.53 66.52,72.53 61.95,77.11 60.43,77.11 58.9,75.58 58.9,73.55 55.35,69.99 54.84,69.99 v1(54.33,69.49)
  Bottom Layer w0.508: v1(54.33,69.49) 38.58,69.49 v1(35.53,72.53) ; R22.2 97.46,51.35 R23.2
S3: length 114.8
  Top Layer w0.508: v1(87.41,58.98) 87.41,64.06 85.38,66.09 85.38,71.2 R26.2 82.33,76.28 70.65,76.28 65.56,81.36 56.42,81.36 v1(54.39,79.32) ; STM32F103C8T6.15 23.11,75.26 37.12,75.26 45.75,83.9 v1(46.26,83.9)
  Bottom Layer w0.508: v1(54.39,79.32) 50.83,79.32 v1(46.26,83.9) ; R24.2 81.68,41.85 81.68,53.25 v1(87.41,58.98)
S4: length 67.8
  Top Layer w0.508: v1(44.95,30.44) 41.39,30.44 v1(40.38,31.46)
  Bottom Layer w0.508: STM32F103C8T6.16 22.92,76.86 34.28,65.49 34.28,45.68 R27.2 40.38,39.59 v1(40.38,31.46) ; R28.2 46.15,29.24 v1(44.95,30.44)
SCL: length 30.8
  Top Layer w0.508: STM32F103C8T6.35 5.14,49.67 5.14,35.84 9.71,31.27 13.77,31.27 OLED.3
SDA: length 26.8
  Top Layer w0.508: v1(14.79,47.52) 14.28,47.02 v1(14.28,39.9) ; v1(12.25,51.71) 9.71,51.71 STM32F103C8T6.36
  Bottom Layer w0.508: v1(12.25,51.71) 14.79,49.17 v1(14.79,47.52) ; v1(14.28,39.9) 18.34,35.84 OLED.4
SOLAR+: length 82.8
  Top Layer w1.27: v1(61.14,74.61) 61.14,63.18 56.06,58.1 56.06,54.29 49.71,47.94 49.71,46.67 48.44,45.4 44.63,45.4 42.09,42.86 42.09,40.32 D1.2
  Bottom Layer w1.27: v1(61.14,74.61) 62.22,75.69 Q3.2 62.22,80.78 75.48,94.04 H1_SolarBoard.1
SOLAR-: length 138.1
  Top Layer w1.268: v1(77.31,40.76) 78.59,39.49 78.59,26.66 R16.1 ; v1(77.94,50.29) 77.94,57.91 v1(63.97,71.88) ; v1(50.57,87.69) 50.57,85.15 48.03,82.61 48.03,77.56 R9.1
  Bottom Layer w1.268: v1(63.97,71.88) 65.24,73.15 65.24,79.5 ; R15.1 64.76,71.18 Q3.3 ; v1(77.31,40.76) 76.67,41.4 76.67,49.02 v1(77.94,50.29) ; v1(50.57,87.69) 54.38,87.69 63.27,96.58 77.24,96.58 H1_SolarBoard.2
  Bottom Layer w1.27: H1_SolarBoard.2 65.24,79.5 Q3.3
$1N47: length 8.2
  Bottom Layer w0.508: Q1.2 32.23,45.54 33.15,46.46 33.15,52.12 R1.2
$1N60: length 21.4
  Top Layer w0.508: v1(63.1,39.43) 62.09,40.45 v1(60.56,40.45)
  Bottom Layer w0.508: C1.1 66.71,35.83 v1(63.1,39.43) ; v1(60.56,40.45) 60.06,40.96 56.05,40.96 U1.2
$1N61: length 16.3
  Top Layer w0.508: U1.4 60.06,38.97 62.05,38.97 C1.2
$1N72: length 42.9
  Top Layer w0.508: R3.2 55.93,29.82 v1(55.93,35.41)
  Bottom Layer w0.508: v1(55.93,35.41) 58.94,35.41 61.98,38.45 61.98,39.98 U3.7 69.06,52.13 74.65,57.72 74.65,58.83 R5.1
$1N76: length 56.9
  Bottom Layer w0.508: R8.2 93.48,15.91 90.38,15.91 89.37,16.93 88.8,16.93 85.75,13.88 Q2.3 ; R4.2 82.98,51.97 82.98,37.03 91.91,28.1 91.91,25.05 88.86,22.01 88.86,16.93
$1N96: length 27
  Top Layer w0.508: v1(76.33,35.58) 72.91,35.58 U3.2
  Bottom Layer w0.508: R16.2 87.52,29.98 R18.1 80.4,31.51 v1(76.33,35.58)
$1N97: length 32.5
  Top Layer w0.508: U3.1 74.44,31.51 R18.2
  Bottom Layer w0.508: R18.2 83.17,24.13 88.03,24.13 90.58,26.67 R19.1
$1N102: length 96.8
  Top Layer w0.508: v1(64.97,86.82) 85.05,86.82 SW1.3 ; v1(51.92,80.37) 51.92,78.34 47.85,74.27 46.33,74.27 43.28,77.32 40.74,77.32 38.2,74.78 v1(38.2,61.58)
  Bottom Layer w0.508: R21.1 38.71,50.18 C7.2 37.18,55.99 37.18,60.56 v1(38.2,61.58) ; v1(64.97,86.82) 59.54,81.39 52.93,81.39 v1(51.92,80.37) ; SW1.3 SW1.4
$1N111: length 41.8
  Bottom Layer w0.508: 87.05,46.46 92.13,51.54 92.13,62.71 89.96,64.88 89.21,64.88 88.2,65.9 88.2,72.62 SW2.3 SW2.4 ; R22.1 87.16,46.46 C8.2
$1N116: length 70.2
  Bottom Layer w0.508: SW3.4 93.28,63.45 93.28,63.06 ; 93.28,63.06 93.28,43.24 R24.1 86.8,35.62 93.57,28.85 93.57,26.72 96.11,24.18 96.11,16.66 92.05,12.59 C9.2 ; 93.28,63.06 89.94,66.39 SW3.3
$1N121: length 99.3
  Top Layer w0.508: R27.1 48.24,41.92 v1(51.29,41.92) ; v1(59.93,37.86) 70.59,27.19 v1(70.59,24.65) ; SW4.3 SW4.4
  Bottom Layer w0.508: 52.81,40.91 52.81,40.4 53.32,39.89 53.32,38.37 53.83,37.86 v1(59.93,37.86) ; 52.81,40.91 57.38,45.48 59.93,45.48 73.13,58.69 73.13,59.05 74.15,60.06 87.87,60.06 89.39,58.54 SW4.3 ; 52.81,40.91 52.31,40.91 v1(51.29,41.92) ; C10.2 73.13,22.11 v1(70.59,24.65)
$1N162: length 27.1
  Bottom Layer w0.508: Q9.2 32.94,37.43 37.01,33.37 37.01,31.33 39.04,29.3 43.44,29.3 44.97,27.78 44.97,22.68 R30.1
$1N174: length 13.2
  Bottom Layer w0.508: R31.1 78.03,12.69 Q2.2
$1N175: length 126.5
  Top Layer w0.508: v1(88.25,75.65) 86.22,77.68 72.5,77.68 LED_Header.2
  Bottom Layer w0.508: v1(88.25,75.65) 96.89,75.65 97.9,74.63 97.9,53.81 94.35,50.25 94.35,29.93 97.4,26.88 97.4,13.17 89.01,4.78 R31.2
$1N181: length 7.3
  Top Layer w0.508: R4.1 v1(75.66,51.12)
  Bottom Layer w0.508: U3.5 74.14,49.59 v1(75.66,51.12)
$1N184: length 68.6
  Top Layer w0.508: v1(71.66,53.21) 71.66,56.76 v1(67.08,61.33)
  Bottom Layer w0.508: 73.69,50.67 73.69,51.17 v1(71.66,53.21) ; R7.1 40.34,81.7 47.5,74.54 52.86,74.54 64.54,62.86 65.56,62.86 v1(67.08,61.33) ; R5.2 81.87,58.85 71.6,48.58 U3.6
$1N187: length 67.4
  Bottom Layer w0.508: R6.2 20.15,5.75 68.55,5.75 Q2.1
$1N191: length 103.8
  Top Layer w0.508: v1(53.64,31.11) 54.15,31.62 54.15,35.17 50.6,38.73 50.6,39.94 51.61,40.96 55.17,40.96 56.18,41.97 69.06,41.97 U3.3 ; v1(50.6,32.12) 49.58,33.14 40.44,33.14 R17.2 ; 61.77,41.97 59.94,41.97 55.87,46.04 55.87,48.07 57.91,50.1 v1(59.94,50.1)
  Bottom Layer w0.508: R20.1 84.2,68.9 75.18,68.9 72.13,65.85 72.13,59.25 62.99,50.1 v1(59.94,50.1) ; v1(50.6,32.12) 52.12,30.6 53.14,30.6 v1(53.64,31.11)

## Text on the board
Top Silkscreen Layer: PWM_CHARGE | ADC_ICHARGE | ADC_ILED | PWM_LED | ADC_VBT | ADC_VSL | SCL | SDA | GND | 5V | S4 | S3 | S2 | S1 | VCC3V3 | VBAT | SOLAR+ | SOLAR-
